# Altium project SCREEN_SAUVC26_PCB.PrjPcb
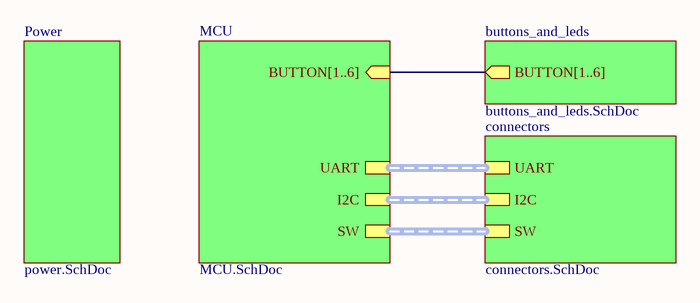
[diagram p0: main.SchDoc]
Version: 01; Title: Плата экрана; Release_Date: 07.10.2025; DrawnBy: Соловьев М.; Decimal_Number_Shematic: ГИДР.123456.020; Decimal_Number_PCB: ГИДР.123456.019
6 sheets, 70 parts. Net scope: hierarchical (ports join the sheet entries above them; power ports are global).
Board file: screen_board.PcbDoc
Sheets:
  main.SchDoc
    buttons_and_leds = buttons_and_leds.SchDoc
    connectors = connectors.SchDoc
    MCU = MCU.SchDoc
    Power = power.SchDoc
  RS485.SchDoc

## Sheet main.SchDoc: Плата экрана
size 420 x 297 mm; SheetNumber: 1; SheetTotal: 5

### Sub-sheets
buttons_and_leds = buttons_and_leds.SchDoc: BUTTON[1..6] (out)
connectors = connectors.SchDoc: UART (harness UART), SW (harness SW), I2C (harness I2C)
MCU = MCU.SchDoc: BUTTON[1..6] (in), UART (harness UART), SW (harness SW), I2C (harness I2C)
Power = power.SchDoc: no entries

### Buses and harness runs
bus sheet buttons_and_leds/BUTTON[1..6] = sheet MCU/BUTTON[1..6]
harness sheet connectors/I2C = sheet MCU/I2C
harness sheet connectors/SW = sheet MCU/SW
harness sheet connectors/UART = sheet MCU/UART

### Notes on the sheet
- Перв. примен.
- Справ. №
- Подп. и дата
- Инв. № дубл.
- Взам. инв. №
- Разраб.
- Изм.
- Лист
- № докум.
- Подп.
- Дата
- Лит.
- Масса
- Масштаб
- Пров.
- Т.контр.
- Схема электрическая принципиальная
- Листов
- Инв. № подл.
- Утв.
- Н.контр.
- Копировал
- Формат А3

## Sheet buttons_and_leds.SchDoc: Плата экрана
size 420 x 297 mm; Address1: Address1; Address2: Address2; Address3: Address3; Address4: Address4; SheetNumber: 2; SheetTotal: 6
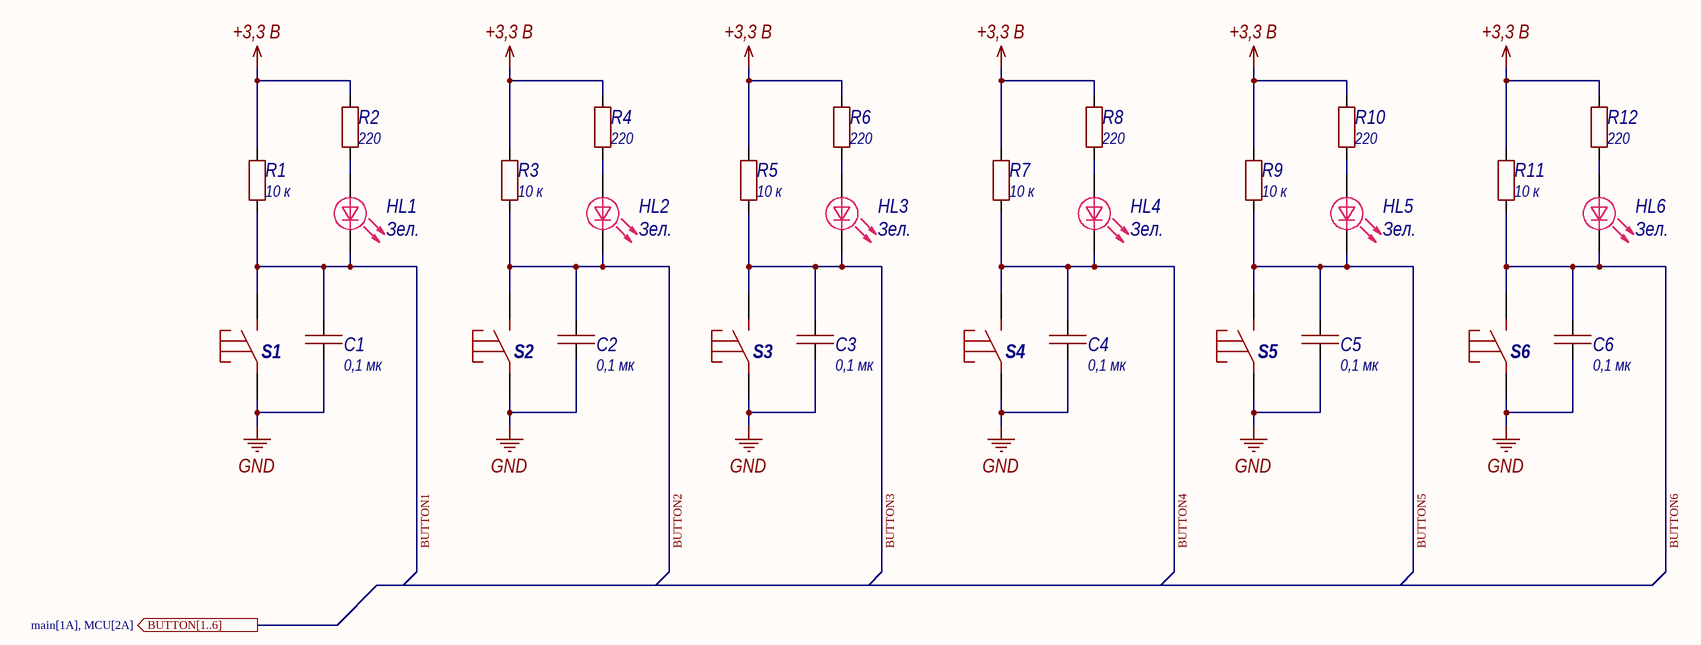
[diagram p1: buttons_and_leds.SchDoc]

### Parts
C1  value 0,1 мк  [0603C]  (hidden comment: Capacitor)
C2  value 0,1 мк  [0603C]  (hidden comment: Capacitor)
C3  value 0,1 мк  [0603C]  (hidden comment: Capacitor)
C4  value 0,1 мк  [0603C]  (hidden comment: Capacitor)
C5  value 0,1 мк  [0603C]  (hidden comment: Capacitor)
C6  value 0,1 мк  [0603C]  (hidden comment: Capacitor)
HL1  Color: Зел.  [0805D]  (hidden comment: LED)
HL2  Color: Зел.  [0805D]  (hidden comment: LED)
HL3  Color: Зел.  [0805D]  (hidden comment: LED)
HL4  Color: Зел.  [0805D]  (hidden comment: LED)
HL5  Color: Зел.  [0805D]  (hidden comment: LED)
HL6  Color: Зел.  [0805D]  (hidden comment: LED)
R1  value 10 к  [0603R]  (hidden comment: Resistor)
R2  value 220  [0603R]  (hidden comment: Resistor)
R3  value 10 к  [0603R]  (hidden comment: Resistor)
R4  value 220  [0603R]  (hidden comment: Resistor)
R5  value 10 к  [0603R]  (hidden comment: Resistor)
R6  value 220  [0603R]  (hidden comment: Resistor)
R7  value 10 к  [0603R]  (hidden comment: Resistor)
R8  value 220  [0603R]  (hidden comment: Resistor)
R9  value 10 к  [0603R]  (hidden comment: Resistor)
R10  value 220  [0603R]  (hidden comment: Resistor)
R11  value 10 к  [0603R]  (hidden comment: Resistor)
R12  value 220  [0603R]  (hidden comment: Resistor)
S1  Button_DIP_12x12  [Button_DIP_12x12]  (value not drawn)
S2  Button_DIP_12x12  [Button_DIP_12x12]  (value not drawn)
S3  Button_DIP_12x12  [Button_DIP_12x12]  (value not drawn)
S4  Button_DIP_12x12  [Button_DIP_12x12]  (value not drawn)
S5  Button_DIP_12x12  [Button_DIP_12x12]  (value not drawn)
S6  Button_DIP_12x12  [Button_DIP_12x12]  (value not drawn)

### Ports
BUTTON[1..6] (out, see main[1A], MCU[2A])

### Nets
+3,3 В: R1.2 R2.1 R3.2 R4.1 R5.2 R6.1 R7.2 R8.1 R9.2 R10.1 R11.2 R12.1
GND: C1.1 C2.1 C3.1 C4.1 C5.1 C6.1 S1.1 S2.1 S3.1 S4.1 S5.1 S6.1
BUTTON1: C1.2 HL1.2 R1.1 S1.2
BUTTON2: C2.2 HL2.2 R3.1 S2.2
BUTTON3: C3.2 HL3.2 R5.1 S3.2
BUTTON4: C4.2 HL4.2 R7.1 S4.2
BUTTON5: C5.2 HL5.2 R9.1 S5.2
BUTTON6: C6.2 HL6.2 R11.1 S6.2
NetHL1_1: HL1.1 R2.2
NetHL2_1: HL2.1 R4.2
NetHL3_1: HL3.1 R6.2
NetHL4_1: HL4.1 R8.2
NetHL5_1: HL5.1 R10.2
NetHL6_1: HL6.1 R12.2

### Notes on the sheet
- Перв. примен.
- Справ. №
- Подп. и дата
- Инв. № дубл.
- Взам. инв. №
- Разраб.
- Изм.
- Лист
- № докум.
- Подп.
- Дата
- Лит.
- Масса
- Масштаб
- Пров.
- Т.контр.
- Схема электрическая принципиальная
- Листов
- Инв. № подл.
- Утв.
- Н.контр.
- Копировал
- Формат А3

### Library data of the parts
C1-C6 = Capacitor_0,1u_10_50V_X7R_0603C: Конденсатор 0603C ёмкостью 0,1 мк 10%, 50 В, X7R; Library Path2: Schematic\Capacitor.SchLib; Voltage (V): 50; Capacity (nF): 100; Part Number: Capacitor_0,1u_10_50V_X7R_0603C; Tolerance: 10%; Dielectric: X7R
HL1-HL6 = LED: Светодиод; Part Number: LED
R1 R3 R5 R7 R9 R11 = Resistor_10k_1_0603: Резистор номиналом 10 кОм 1%; Power: *; Part Number: Resistor_10k_1_0603; Tolerance: 1%
R2 R4 R6 R8 R10 R12 = Resistor_220_1_0603: Резистор номиналом 220 Ом 1%; Power: *; Part Number: Resistor_220_1_0603; Tolerance: 1%
S1-S6 = Button_DIP_12x12: Тактовая кнопка, DIP 12 x 12 мм; Part Number: Button_DIP_12x12

## Sheet connectors.SchDoc: Плата экрана
size 420 x 297 mm; SheetNumber: 5; SheetTotal: 5
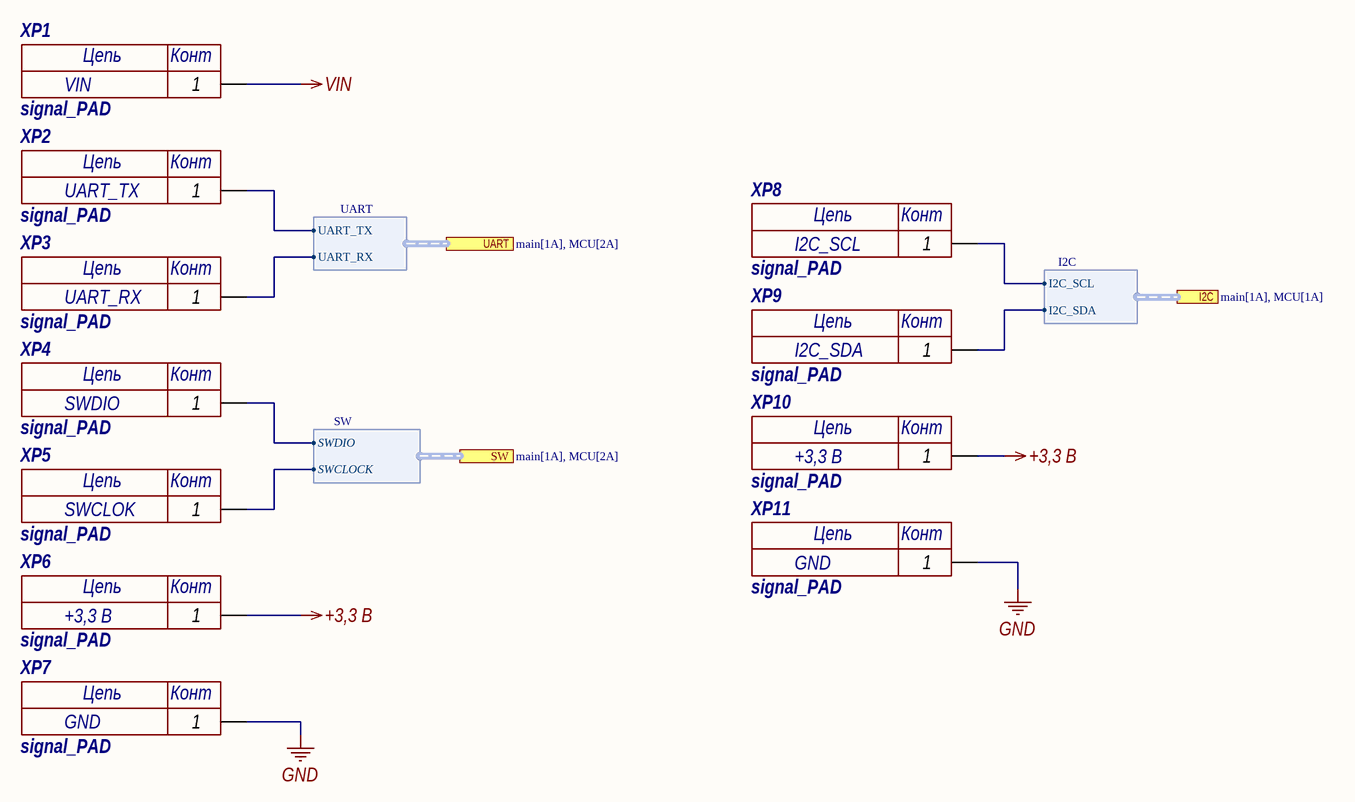
[diagram p2: connectors.SchDoc]

### Parts
XP1  signal_PAD  Value1: VIN  [SS_PAD]
XP2  signal_PAD  Value1: UART_TX  [SS_PAD]
XP3  signal_PAD  Value1: UART_RX  [SS_PAD]
XP4  signal_PAD  Value1: SWDIO  [SS_PAD]
XP5  signal_PAD  Value1: SWCLOK  [SS_PAD]
XP6  signal_PAD  Value1: +3,3 В  [SS_PAD]
XP7  signal_PAD  Value1: GND  [SS_PAD]
XP8  signal_PAD  Value1: I2C_SCL  [SS_PAD]
XP9  signal_PAD  Value1: I2C_SDA  [SS_PAD]
XP10  signal_PAD  Value1: +3,3 В  [SS_PAD]
XP11  signal_PAD  Value1: GND  [SS_PAD]

### Ports
I2C (harness I2C, see main[1A], MCU[1A]), SW (harness SW, see main[1A], MCU[2A]), UART (harness UART, see main[1A], MCU[2A])

### Harnesses
UART: UART_RX, UART_TX
I2C: I2C_SDA, I2C_SCL
SW: SWCLOCK, SWDIO

### Nets
+3,3 В: XP6.1 XP10.1
GND: XP7.1 XP11.1
VIN: XP1.1
I2C_SCL: XP8.1 ; port I2C.I2C_SCL
I2C_SDA: XP9.1 ; port I2C.I2C_SDA
SWCLOCK: XP5.1 ; port SW.SWCLOCK
SWDIO: XP4.1 ; port SW.SWDIO
NetXP2_1: XP2.1 ; port UART.UART_TX
NetXP3_1: XP3.1 ; port UART.UART_RX

### Notes on the sheet
- Перв. примен.
- Справ. №
- Подп. и дата
- Инв. № дубл.
- Взам. инв. №
- Разраб.
- Изм.
- Лист
- № докум.
- Подп.
- Дата
- Лит.
- Масса
- Масштаб
- Пров.
- Т.контр.
- Схема электрическая принципиальная
- Листов
- Инв. № подл.
- Утв.
- Н.контр.
- Копировал
- Формат А3
- (in symbol signal_PAD) Цепь; Конт

### Library data of the parts
XP1-XP11 = signal_PAD: контактная площадка под пайку тонких проводов; System: Connector; Part Number: signal_PAD

## Sheet MCU.SchDoc: Плата экрана
size 420 x 297 mm; Address1: Address1; Address2: Address2; Address3: Address3; Address4: Address4; SheetNumber: 4; SheetTotal: 6
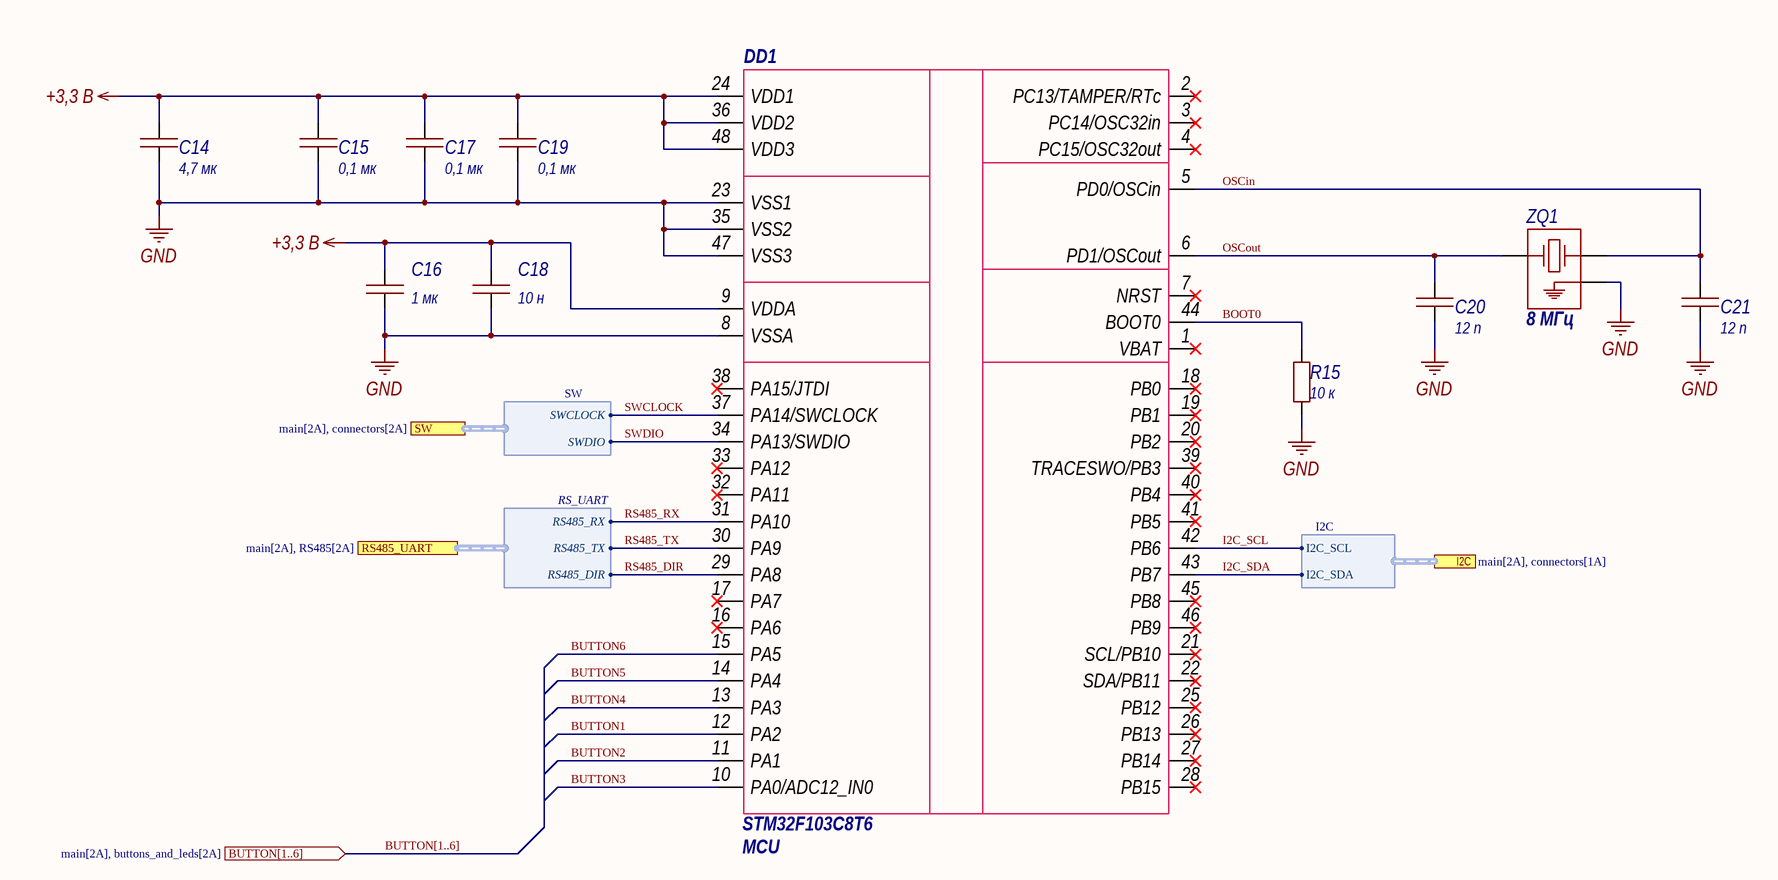
[diagram p3: MCU.SchDoc]

### Parts
C14  value 4,7 мк  [1206C]  (hidden comment: Capacitor)
C15  value 0,1 мк  [0603C]  (hidden comment: Capacitor)
C16  value 1 мк  [0603C]  (hidden comment: Capacitor)
C17  value 0,1 мк  [0603C]  (hidden comment: Capacitor)
C18  value 10 н  [0603C]  (hidden comment: Capacitor)
C19  value 0,1 мк  [0603C]  (hidden comment: Capacitor)
C20  value 12 п  [0603C]  (hidden comment: Capacitor)
C21  value 12 п  [0603C]  (hidden comment: Capacitor)
DD1  STM32F103C8T6  Value1: MCU  [LQFP48]
R15  value 10 к  [0603R]  (hidden comment: Resistor)
ZQ1  value 8 МГц  [QSMD3.2x2.5]  (hidden comment: XTAL_GND)

### Ports
BUTTON[1..6] (in, see main[2A], buttons_and_leds[2A]), I2C (harness I2C, see main[2A], connectors[1A]), RS485_UART (harness RS_UART, see main[2A], RS485[2A]), SW (harness SW, see main[2A], connectors[2A])

### Harnesses
SW: SWCLOCK, SWDIO
I2C: I2C_SDA, I2C_SCL
RS_UART: RS485_RX, RS485_TX, RS485_DIR

### Nets
+3,3 В: C14.2 C15.2 C16.2 C17.2 C18.2 C19.2 DD1.9(VDDA) DD1.24(VDD1) DD1.36(VDD2) DD1.48(VDD3)
GND: C14.1 C15.1 C16.1 C17.1 C18.1 C19.1 C20.1 C21.1 DD1.8(VSSA) DD1.23(VSS1) DD1.35(VSS2) DD1.47(VSS3) R15.1 ZQ1.3
BOOT0: DD1.44(BOOT0) R15.2
BUTTON1: DD1.12(PA2)
BUTTON2: DD1.11(PA1)
BUTTON3: DD1.10(PA0/ADC12_IN0)
BUTTON4: DD1.13(PA3)
BUTTON5: DD1.14(PA4)
BUTTON6: DD1.15(PA5)
I2C_SCL: DD1.42(PB6) ; port I2C.I2C_SCL
I2C_SDA: DD1.43(PB7) ; port I2C.I2C_SDA
OSCin: C21.2 DD1.5(PD0/OSCin) ZQ1.2
OSCout: C20.2 DD1.6(PD1/OSCout) ZQ1.1
RS485_DIR: DD1.29(PA8) ; port RS485_UART.RS485_DIR
RS485_RX: DD1.31(PA10) ; port RS485_UART.RS485_RX
RS485_TX: DD1.30(PA9) ; port RS485_UART.RS485_TX
SWCLOCK: DD1.37(PA14/SWCLOCK) ; port SW.SWCLOCK
SWDIO: DD1.34(PA13/SWDIO) ; port SW.SWDIO

Not connected (* = marked no-connect by the designer): DD1 1(VBAT)* 2(PC13/TAMPER/RTc)* 3(PC14/OSC32in)* 4(PC15/OSC32out)* 7(NRST)* 16(PA6)* 17(PA7)* 18(PB0)* 19(PB1)* 20(PB2)* 21(SCL/PB10)* 22(SDA/PB11)* 25(PB12)* 26(PB13)* 27(PB14)* 28(PB15)* 32(PA11)* 33(PA12)* 38(PA15/JTDI)* 39(TRACESWO/PB3)* 40(PB4)* 41(PB5)* 45(PB8)* 46(PB9)*

### Buses and harness runs
bus BUTTON[1..6] = port BUTTON[1..6]

### Notes on the sheet
- Перв. примен.
- Справ. №
- Подп. и дата
- Инв. № дубл.
- Взам. инв. №
- Разраб.
- Изм.
- Лист
- № докум.
- Подп.
- Дата
- Лит.
- Масса
- Масштаб
- Пров.
- Т.контр.
- Схема электрическая принципиальная
- Листов
- Инв. № подл.
- Утв.
- Н.контр.
- Копировал
- Формат А3

### Library data of the parts
C14 = Capacitor_4,7u_10_50V_X7R_1206C: Конденсатор 1206C ёмкостью 4,7 мк 10%, 50 В, X7R; Library Path2: Schematic\Capacitor.SchLib; Voltage (V): 50; Capacity (nF): 4700; Part Number: Capacitor_4,7u_10_50V_X7R_1206C; Tolerance: 10%; Dielectric: X7R
C15 C17 C19 = Capacitor_0,1u_10_50V_X7R_0603C: as C1 on sheet buttons_and_leds; Part Number: Capacitor_0,1u_10_50V_X7R_0603C; Tolerance: 10%; Dielectric: X7R
C16 = Capacitor_1u_10_50V_X7R_0603C: Конденсатор 0603C ёмкостью 1 мк 10%, 50 В, X7R; Library Path2: Schematic\Capacitor.SchLib; Voltage (V): 50; Capacity (nF): 1000; Part Number: Capacitor_1u_10_50V_X7R_0603C; Tolerance: 10%; Dielectric: X7R
C18 = Capacitor_10n_10_50V_X7R_0603C: Конденсатор 0603C ёмкостью 10 н 10%, 50 В, X7R; Library Path2: Schematic\Capacitor.SchLib; Voltage (V): 50; Capacity (nF): 10; Part Number: Capacitor_10n_10_50V_X7R_0603C; Tolerance: 10%; Dielectric: X7R
C20 C21 = 0,1 мк: Конденсатор 12п; Part Number: Capacitor
DD1 = STM32F103C8T6: Микроконтроллер; Manufacturer: ST Microelectronics; Rate: -0,3...4,0В; Shop: магазин с самой дешевой ценой; Notice: 48 пиновая версия STM32F103; Datasheet: http://www.st.com/content/ccc/resource/technical/document/datasheet/33/d4/6f/1d/df/0b/4c/6d/CD00161566.pdf/files/CD00161566.pdf/jcr:content/translations/en.CD00161566.pdf; Case: корпус; Part Number: STM32F103C8T6
R15 = Resistor_10k_1_0603: Резистор номиналом 10 кОм 1%; Power: *; Part Number: Resistor_10k_1_0603; Tolerance: 1%
ZQ1 = XTAL_GND: Кварцевый резонатор с входом земли; Part Number: XTAL_GND

## Sheet power.SchDoc: Плата экрана
size 420 x 297 mm; Address1: Address1; Address2: Address2; Address3: Address3; Address4: Address4; SheetNumber: 3; SheetTotal: 6
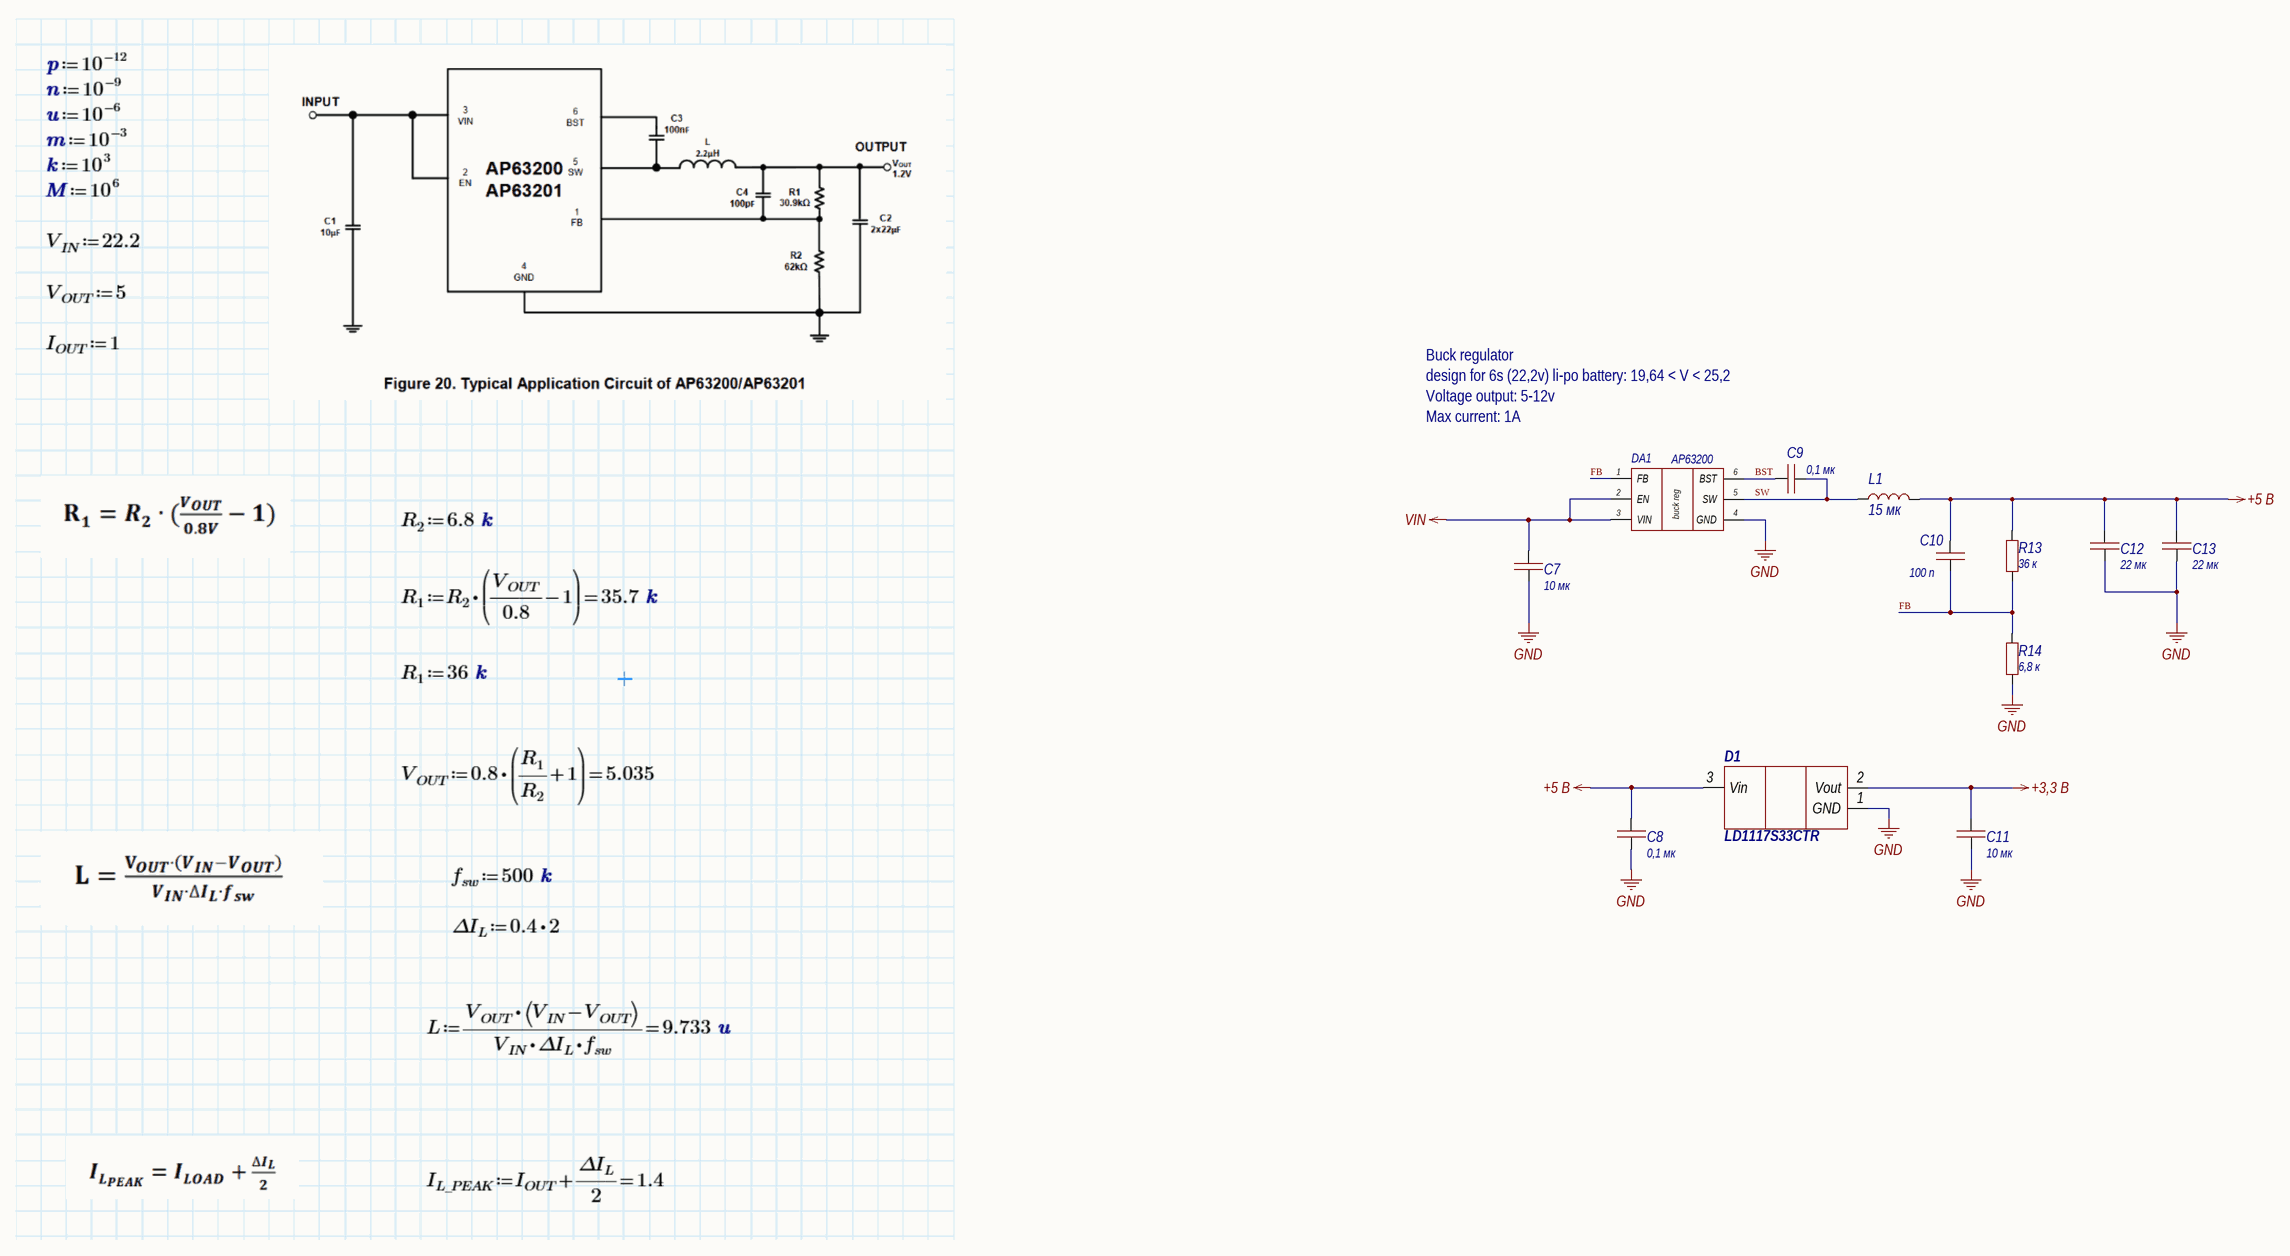
[diagram p4: power.SchDoc]

### Parts
C7  value 10 мк  [1210C]  (hidden comment: Capacitor)
C8  value 0,1 мк  [0603C]  (hidden comment: Capacitor)
C9  value 0,1 мк  [0603C]  (hidden comment: Capacitor)
C10  value 100 п  [0603C]  (hidden comment: Capacitor)
C11  value 10 мк  [1210C]  (hidden comment: Capacitor)
C12  value 22 мк  [1210C]  (hidden comment: Capacitor)
C13  value 22 мк  [1210C]  (hidden comment: Capacitor)
D1  LD1117S33CTR  [SOT223]
DA1  AP63200  [TSOT26]
L1  value 15 мк  [SP43]  (hidden comment: SP43-150K)
R13  value 36 к  [0603R]  (hidden comment: Resistor)
R14  value 6,8 к  [0603R]  (hidden comment: Resistor)

### Nets
+3,3 В: C11.2 D1.2(Vout)
+5 В: C8.2 C10.2 C12.2 C13.2 D1.3(Vin) L1.2 R13.2
GND: C7.1 C8.1 C11.1 C12.1 C13.1 D1.1(GND) DA1.4(GND) R14.1
VIN: C7.2 DA1.2(EN) DA1.3(VIN)
BST: C9.1 DA1.6(BST)
FB: C10.1 DA1.1(FB) R13.1 R14.2
SW: C9.2 DA1.5(SW) L1.1

### Notes on the sheet
- Buck regulator
- design for 6s (22,2v) li-po battery: 19,64 < V < 25,2
- Voltage output: 5-12v
- Max current: 1A
- Перв. примен.
- Справ. №
- Подп. и дата
- Инв. № дубл.
- Взам. инв. №
- Разраб.
- Изм.
- Лист
- № докум.
- Подп.
- Дата
- Лит.
- Масса
- Масштаб
- Пров.
- Т.контр.
- Схема электрическая принципиальная
- Листов
- Инв. № подл.
- Утв.
- Н.контр.
- Копировал
- Формат А3
- (in symbol AP63200) buck reg

### Library data of the parts
C7 = Capacitor_10u_10_35V_X7R_1210C: Конденсатор 1210C ёмкостью 10 мк 10%, 35 В, X7R; Library Path2: Schematic\Capacitor.SchLib; Voltage (V): 35; Capacity (nF): 10000; Part Number: Capacitor_10u_10_35V_X7R_1210C; Tolerance: 10%; Dielectric: X7R
C8 = Capacitor_0,1u_10_50V_X7R_0603C: Конденсатор 0603C ёмкостью 0,1 мк 10%, 50 В, X7R; Voltage (V): 50; Capacity (nF): 100; Part Number: Capacitor_0,1u_10_50V_X7R_0603C; Tolerance: 10%; Dielectric: X7R
C9 = Capacitor_0,1u_10_50V_X7R_0603C: as C1 on sheet buttons_and_leds; Part Number: Capacitor_0,1u_10_50V_X7R_0603C; Tolerance: 10%; Dielectric: X7R
C10 = Capacitor_100p_10_50V_X7R_0603C: Конденсатор 0603C ёмкостью 100 п 10%, 50 В, X7R; Library Path2: Schematic\Capacitor.SchLib; Voltage (V): 50; Capacity (nF): 0,1; Part Number: Capacitor_100p_10_50V_X7R_0603C; Tolerance: 10%; Dielectric: X7R
C11 = Capacitor_10u_10_35V_X7R_1210C: Конденсатор 1210C ёмкостью 10 мк 10%, 35 В, X7R; Voltage (V): 35; Capacity (nF): 10000; Part Number: Capacitor_10u_10_35V_X7R_1210C; Tolerance: 10%; Dielectric: X7R
C12 C13 = Capacitor_22u_10_25V_X7R_1210C: Конденсатор 1210C ёмкостью 22 мк 10%, 25 В, X7R; Library Path2: Schematic\Capacitor.SchLib; Voltage (V): 25; Capacity (nF): 22000; Part Number: Capacitor_22u_10_25V_X7R_1210C; Tolerance: 10%; Dielectric: X7R
D1 = LD1117S33CTR: Линейный стабилизатор напряжения; Part Number: LD1117S33CTR
DA1 = AP63200: DC-DC понижающий преобразователь, Vin: 3.8 - 40 В, adj, 2 А; Part Number: AP63200
L1 = SP43-150K: Индуктивность на 15 мкГн, номинальный ток 1,3 А; Inductance (μH): 15; Current (A): 1,3; Part Number: SP43-150K
R13 = Resistor_36k_1_0603: Резистор номиналом 36 кОм 1%; Power: *; Part Number: Resistor_36k_1_0603; Tolerance: 1%
R14 = Resistor_6.8k_1_0603: Резистор номиналом 6,8 кОм 1%; Power: *; Part Number: Resistor_6.8k_1_0603; Tolerance: 1%

## Sheet RS485.SchDoc: Плата экрана
size 420 x 297 mm; SheetNumber: 6; SheetTotal: 6
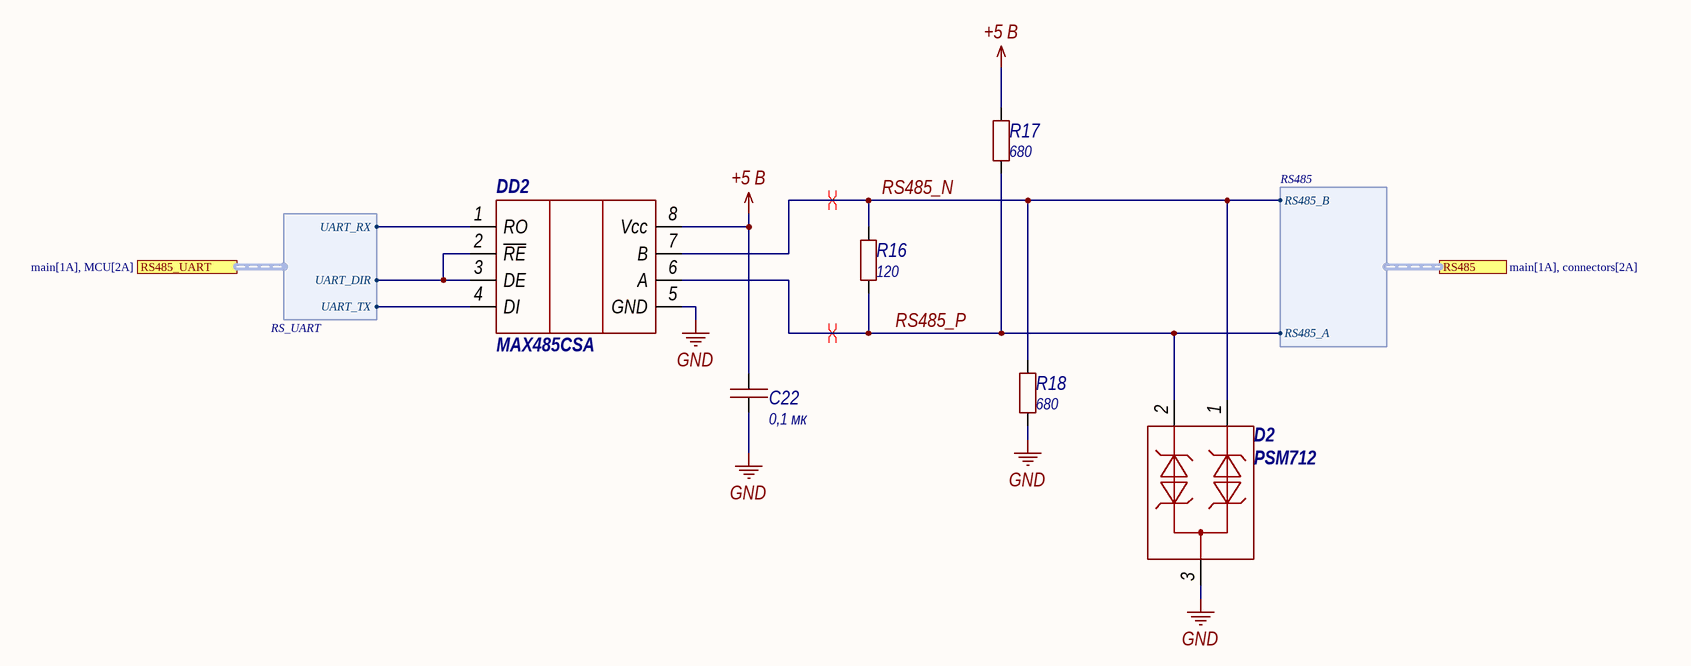
[diagram p5: RS485.SchDoc]

### Parts
C22  value 0,1 мк  [0603C]  (hidden comment: Capacitor)
D2  PSM712  [SOT23-3]
DD2  MAX485CSA  [SOIC-8]
R16  value 120  [1206R]  (hidden comment: Resistor)
R17  value 680  [0603R]  (hidden comment: Resistor)
R18  value 680  [0603R]  (hidden comment: Resistor)

### Ports
RS485 (harness RS485, see main[1A], connectors[2A]), RS485_UART (harness RS_UART, see main[1A], MCU[2A])

### Harnesses
RS485: RS485_B, RS485_A
RS_UART: UART_RX, UART_TX, UART_DIR

### Nets
+5 В: C22.2 DD2.8(Vcc) R17.2
GND: C22.1 D2.3 DD2.5(GND) R18.1
RS485_N: D2.1 DD2.7(B) R16.2 R18.2 ; port RS485.RS485_B
RS485_P: D2.2 DD2.6(A) R16.1 R17.1 ; port RS485.RS485_A
NetDD2_1: DD2.1(RO) ; port RS485_UART.UART_RX
NetDD2_2: DD2.2(~{RE}) DD2.3(DE) ; port RS485_UART.UART_DIR
NetDD2_4: DD2.4(DI) ; port RS485_UART.UART_TX

### Layout directives
differential pair: RS485_N, RS485_P

### Notes on the sheet
- Перв. примен.
- Справ. №
- Подп. и дата
- Инв. № дубл.
- Взам. инв. №
- Разраб.
- Изм.
- Лист
- № докум.
- Подп.
- Дата
- Лит.
- Масса
- Масштаб
- Пров.
- Т.контр.
- Схема электрическая принципиальная
- Листов
- Инв. № подл.
- Утв.
- Н.контр.
- Копировал
- Формат А3

### Library data of the parts
C22 = Capacitor_0,1u_10_50V_X7R_0603C: as C8 on sheet power; Part Number: Capacitor_0,1u_10_50V_X7R_0603C; Tolerance: 10%; Dielectric: X7R
D2 = PSM712: Защитный диод для линии RS-485; Part Number: PSM712; Interface: RS-485
DD2 = MAX485CSA: RS-485 приёмопередатчик; Part Number: MAX485CSA
R16 = Resistor_120_1_0603: Резистор номиналом 120 Ом 1%; Power: *; Part Number: Resistor_120_1_0603; Tolerance: 1%
R17 R18 = Resistor_680_1_0603: Резистор номиналом 680 Ом 1%; Power: *; Part Number: Resistor_680_1_0603; Tolerance: 1%

## Nets that join several sheets
+3,3 В: buttons_and_leds (12 pins), connectors (XP6.1 XP10.1), MCU (10 pins), power (C11.2 D1.2)
+5 В: power (7 pins), RS485 (C22.2 DD2.8 R17.2)
GND: buttons_and_leds (12 pins), connectors (XP7.1 XP11.1), MCU (14 pins), power (8 pins), RS485 (C22.1 D2.3 DD2.5 R18.1)
VIN: connectors (XP1.1), power (C7.2 DA1.2 DA1.3)
I2C_SCL: connectors (XP8.1), MCU (DD1.42)
I2C_SDA: connectors (XP9.1), MCU (DD1.43)
SWCLOCK: connectors (XP5.1), MCU (DD1.37)
SWDIO: connectors (XP4.1), MCU (DD1.34)

## Assembly variants
01: all parts fitted